# EAGLE design raspberrypi_to_ws2801_v4 (EAGLE 6.4)
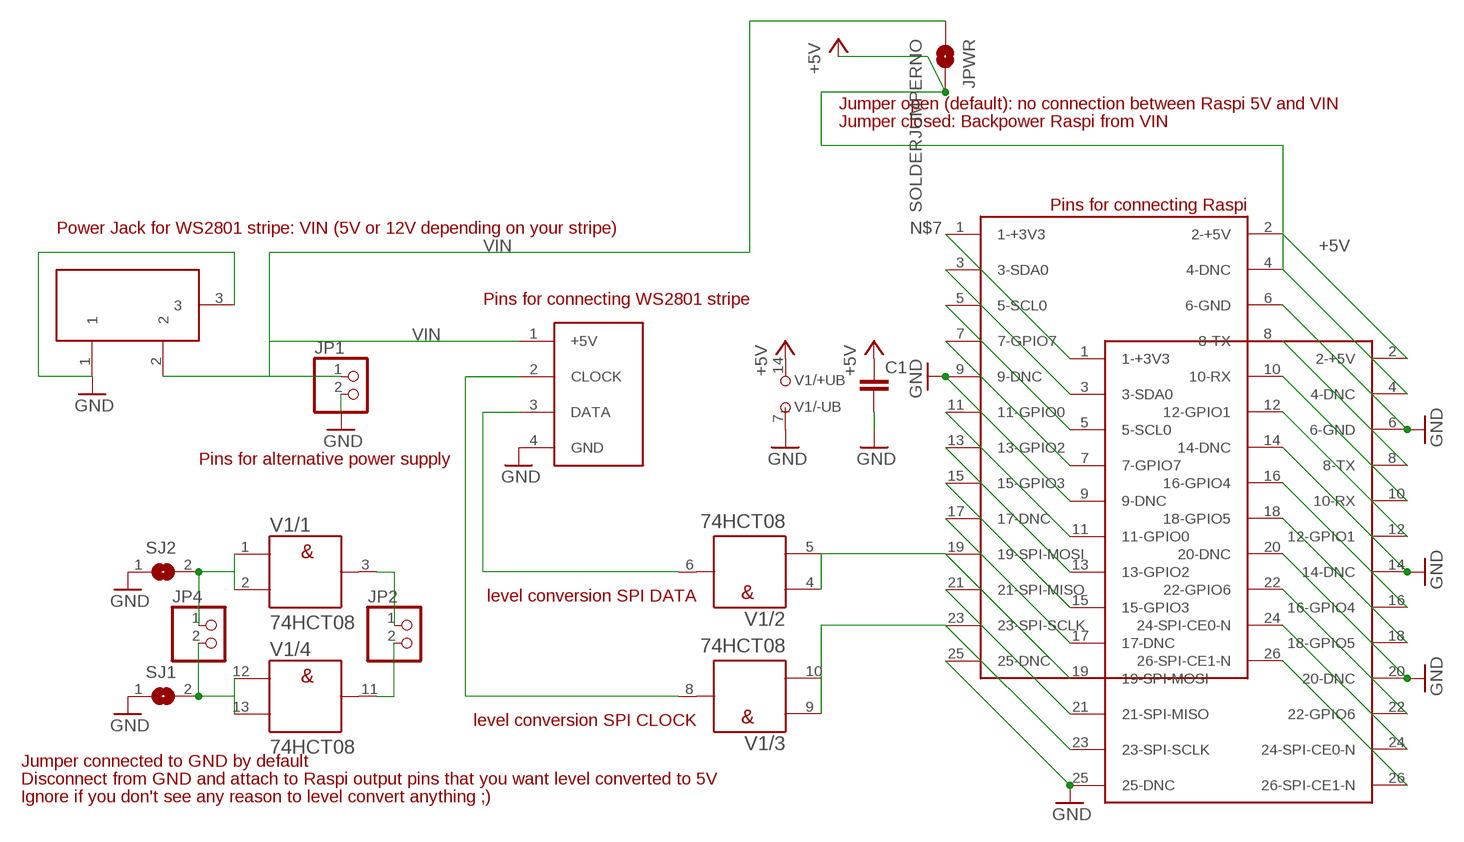
[diagram p0: schematic, sheet 1]

## Parts
C1  C-EU025-024X044  [C025-024X044]
JP1  PINHD-1X2  [1X02]
JP2  PINHD-1X2  [1X02]
JP4  PINHD-1X2  [1X02]
JPWR  SOLDERJUMPERNO  [SJ_2S-NO]
SJ1  SJ  [SJ]
SJ2  SJ  [SJ]
U$1  RASPBERRY-PI  [RASPBERRY-PI]
U$2  RASPBERRY-PI  [RASPBERRY-PI]
U$3  W2801STRIP  [1X04]
U$5  DC21MMX  [DC-21MM]
V1  74HCT08  7408N  [DIL14]

## Nets
+5V: C1.1 JPWR.2 U$1.2(2-+5V) U$1.4(4-DNC) U$2.2(2-+5V) U$2.4(4-DNC) V1.14(/+UB:+UB)
GND: C1.2 JP1.2 SJ1.1 SJ2.1 U$1.6(6-GND) U$1.9(9-DNC) U$1.14(14-DNC) U$1.20(20-DNC) U$1.25(25-DNC) U$2.6(6-GND) U$2.9(9-DNC) U$2.14(14-DNC) U$2.20(20-DNC) U$2.25(25-DNC) U$3.4(GND) U$5.1 U$5.3 V1.7(/-UB:-UB)
N$1: U$1.19(19-SPI-MOSI) U$2.19(19-SPI-MOSI) V1.4(/2:A) V1.5(/2:B)
N$2: U$3.2(CLOCK) V1.8(/3:Y)
N$3: U$1.23(23-SPI-SCLK) U$2.23(23-SPI-SCLK) V1.9(/3:A) V1.10(/3:B)
N$4: U$1.3(3-SDA0) U$2.3(3-SDA0)
N$6: U$1.5(5-SCL0) U$2.5(5-SCL0)
N$7: U$1.1(1-+3V3) U$2.1(1-+3V3)
N$8: U$1.7(7-GPIO7) U$2.7(7-GPIO7)
N$9: U$1.8(8-TX) U$2.8(8-TX)
N$11: U$1.10(10-RX) U$2.10(10-RX)
N$12: U$1.11(11-GPIO0) U$2.11(11-GPIO0)
N$13: U$1.12(12-GPIO1) U$2.12(12-GPIO1)
N$14: U$1.13(13-GPIO2) U$2.13(13-GPIO2)
N$16: U$1.15(15-GPIO3) U$2.15(15-GPIO3)
N$17: U$1.16(16-GPIO4) U$2.16(16-GPIO4)
N$18: U$1.17(17-DNC) U$2.17(17-DNC)
N$19: U$1.18(18-GPIO5) U$2.18(18-GPIO5)
N$21: U$1.21(21-SPI-MISO) U$2.21(21-SPI-MISO)
N$22: U$1.22(22-GPIO6) U$2.22(22-GPIO6)
N$23: U$1.24(24-SPI-CE0-N) U$2.24(24-SPI-CE0-N)
N$25: U$1.26(26-SPI-CE1-N) U$2.26(26-SPI-CE1-N)
N$26: U$3.3(DATA) V1.6(/2:Y)
N$27: JP2.1 V1.3(/1:Y)
N$28: JP2.2 V1.11(/4:Y)
N$33: JP4.2 SJ1.2 V1.12(/4:A) V1.13(/4:B)
N$34: JP4.1 SJ2.2 V1.1(/1:A) V1.2(/1:B)
VIN: JP1.1 JPWR.1 U$3.1(+5V) U$5.2

## Notes on the sheet
- Jumper open (default): no connection between Raspi 5V and VIN
- Jumper closed: Backpower Raspi from VIN
- Pins for connecting Raspi
- Power Jack for WS2801 stripe: VIN (5V or 12V depending on your stripe)
- Pins for connecting WS2801 stripe
- Pins for alternative power supply
- level conversion SPI DATA
- level conversion SPI CLOCK
- Jumper connected to GND by default
- Disconnect from GND and attach to Raspi output pins that you want level converted to 5V
- Ignore if you don't see any reason to level convert anything ;)

## Library data of the parts
C1 = rcl:C-EU: CAPACITOR, European symbol
JP1 = pinhead:PINHD-1X2: PIN HEADER
JP2 JP4 = pins:PINHD-1X2: PIN HEADER
JPWR = SparkFun-Passives:SOLDERJUMPER: Solder Jumper Standard SMD solder jumper. Used to automate production. Two varients : Normally Open and Normally Closed are the same, but have different paste layers. NC will have a large amount of paste and should jumper during reflow.
SJ1 SJ2 = jumper:SJ: SMD solder JUMPER
U$1 U$2 = RaspberryPi:RASPBERRY-PI: Raspberry Pi Board <http://www.raspberrypi.org/> Jacques Lagnel V1.0 (beta) 2012 Board dimension: Forum 3D model <http://www.raspberrypi.org/forum/general-discussion/mechanical-profile-3d-models?value=3d%20model&type=1&include=1&search=1&ret=all> The GPIO Connector (P1): http://elinux.org/RPi_Low-level_peripherals
U$3 = w2801strip:W2801STRIP
U$5 = powersupply:DC21MM
V1 = 74ttl-din:74*08: Quad 2-input AND gate

## Board
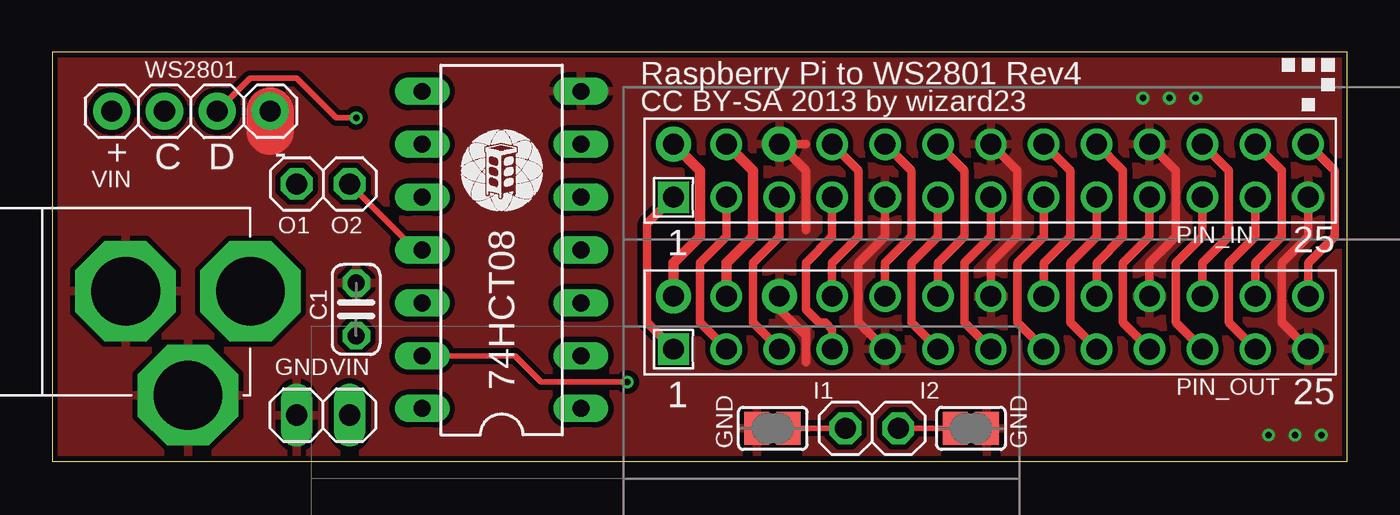
[diagram p1: board, top side]
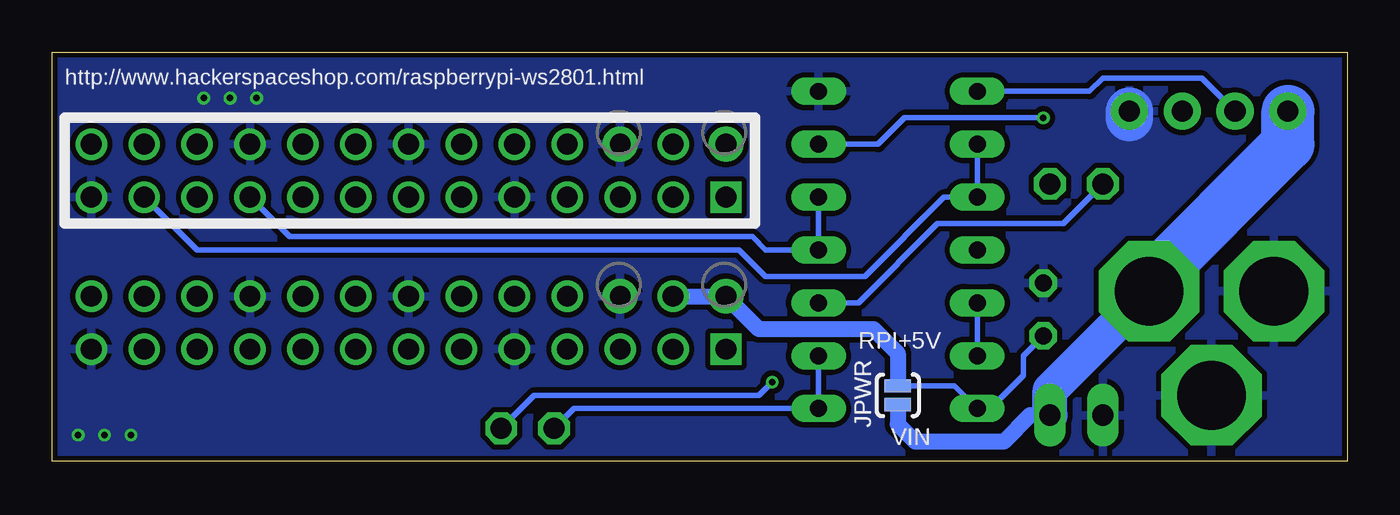
[diagram p2: board, bottom side, seen from below]

Size 62.21 x 19.67 mm. Coordinates in mm from the lower left corner, seen from the top.
Outline: 0,0 62.21,0 62.21,19.67 0,19.67 0,0
Copper layers (1*16): Top 0.035mm / dielectric 1.5mm / Bottom 0.035mm
Design rules "Fusion_eagle_rule_v1.1": minimum track width 6mil, minimum drill 12mil, track to track 6mil, track to pad 6mil, pad to pad 6mil, via to via 6mil, smd to smd 0mil, copper to edge 10mil, drill to drill 10mil, minimum pad ring 10mil, minimum via ring 6mil, stop-mask expansion 2mil, vias tented up to drill 100mil, thermal gap 10mil

### Footprints (pad centres in the part's own frame; a part is rotated, then mirrored left to right if it is on the bottom)
C025-024X044 = drill 0.813 octagon: 1 -1.27,0; 2 1.27,0
1X02 = drill 1.016 long: 1 -1.27,0; 2 1.27,0
1X02' = drill 1.016 octagon: 1 -1.27,0; 2 1.27,0
SJ_2S-NO = smd 0.635 x 1.27: 1 -0.45,0; 2 0.45,0
SJ = smd 1.168 x 1.6: 1 -0.762,0; 2 0.762,0
RASPBERRY-PI = drill 1 square: 1 0,0 | drill 1 pad 1.676: 2 0,2.54; 6 5.08,2.54 | drill 1: 3 2.54,0; 4 2.54,2.54; 5 5.08,0; 7 7.62,0; 8 7.62,2.54; 9 10.16,0; 10 10.16,2.54; 11 12.7,0; 12 12.7,2.54; 13 15.24,0; 14 15.24,2.54; 15 17.78,0; 16 17.78,2.54; 17 20.32,0; 18 20.32,2.54; 19 22.86,0; 20 22.86,2.54; 21 25.4,0; 22 25.4,2.54; 23 27.94,0; 24 27.94,2.54; 25 30.48,0; 26 30.48,2.54
1X04 = drill 1.016 pad 1.778: 1 -3.81,0; 2 -1.27,0; 3 1.27,0; 4 3.81,0
DC-21MM = drill 3.302 pad 4.826 octagon: 1 -5.08,-3.353; 2 -0.076,-6.35; 3 -0.076,-0.356
DIL14 = drill 0.813 long: 1 -7.62,-3.81; 2 -5.08,-3.81; 3 -2.54,-3.81; 4 0,-3.81; 5 2.54,-3.81; 6 5.08,-3.81; 7 7.62,-3.81; 8 7.62,3.81; 9 5.08,3.81; 10 2.54,3.81; 11 0,3.81; 12 -2.54,3.81; 13 -5.08,3.81; 14 -7.62,3.81

### Placement (x,y rotation side)
C1  14.61,7.3 90 top
JP1  13.02,2.22 180 top
JP2  [1X02']  13.02,13.34 0 top
JP4  [1X02']  39.37,1.59 0 top
JPWR  21.59,3.17 90 bottom
SJ1  44.13,1.59 180 top
SJ2  34.61,1.59 0 top
U$1  29.84,12.7 0 top
U$2  29.84,5.4 0 top
U$3  6.67,16.83 0 top
U$4  [METALAB_SMALL]  21.59,13.97 0 top
U$5  3.17,8.26 90 top
V1  21.59,10.16 90 top

### Tracks (layer width: path | path; a pad name or v marks a point on that pad's centre or on a via)
+5V
  Top 0.508: U$1.2 31.11,13.97 31.11,10.79 29.84,9.53 U$2.2 | U$1.4 33.66,13.97 33.66,10.79 32.38,9.53 U$2.4
  Bottom 0.254: C1.1 15.56,5.08 15.56,4.13 17.14,2.54 V1.14 18.86,3.62 JPWR.2
  Bottom 0.305: 21.59,3.81 JPWR.2
  Bottom 0.762: 21.59,3.81 21.59,5.19 22.75,6.35 28.26,6.35 U$2.2 U$2.4
GND  (via drill 0.31)
  Top 0.406: 34.92,8.57 U$2.6 34.92,7.62 | 36.2,11.11 36.2,13.97 U$1.6 36.2,15.24 | 36.2,6.03 36.2,4.76 | 36.2,6.03 36.2,6.35 | 34.92,7.3 36.2,6.03 | U$1.9 40.01,10.79 38.73,9.53 38.73,6.67 U$2.9 | U$1.14 46.35,13.97 46.35,10.79 45.09,9.53 U$2.14 | U$1.20 53.98,13.97 53.98,10.79 52.7,9.53 U$2.20 | U$1.25 60.33,10.79 59.05,9.53 59.05,6.67 U$2.25
  Top 2.286: U$3.4 10.48,15.88
  Bottom 2.286: U$3.4 10.48,16.51
  other vias: 52.39,17.46 59.69,1.27 60.96,1.27 53.66,17.46 54.93,17.46 58.42,1.27
  pour Top (isolate 0.254): 0,0 0,19.68 62.23,19.68 62.23,0
  pour Bottom (isolate 0.254): 0,19.68 62.23,19.68 62.23,0 0,0
N$1
  Top 0.406: U$2.19 51.44,6.67 51.44,9.53 52.7,10.79 U$1.19
  Bottom 0.254: V1.5 V1.4 27.94,10.16 28.57,10.79 50.8,10.79 U$1.19
N$2
  Bottom 0.254: V1.8 12.38,17.78 11.75,18.41 6.99,18.41 U$3.2
N$3
  Top 0.406: U$2.23 56.52,6.67 56.52,9.53 57.78,10.79 U$1.23
  Bottom 0.254: V1.9 V1.10 19.37,12.7 23.18,8.89 27.94,8.89 29.21,10.16 55.24,10.16 U$1.23
N$4
  Top 0.406: U$1.3 32.38,10.79 31.11,9.53 31.11,6.67 U$2.3
N$6
  Top 0.406: U$1.5 34.92,10.79 33.66,9.53 33.66,6.67 U$2.5
N$7
  Top 0.406: U$1.1 28.57,11.43 28.57,6.67 U$2.1
N$8
  Top 0.406: U$1.7 37.47,10.79 36.2,9.53 36.2,7.3 36.83,6.67 37.15,6.67 37.47,6.35 U$2.7
N$9
  Top 0.406: U$1.8 38.73,13.97 38.73,10.79 37.47,9.53 U$2.8
N$11
  Top 0.406: U$1.10 41.27,13.97 41.27,10.79 40.01,9.53 U$2.10
N$12
  Top 0.406: U$1.11 42.55,10.79 41.27,9.53 41.27,6.67 U$2.11
N$13
  Top 0.406: U$1.12 43.81,13.97 43.81,10.79 42.55,9.53 U$2.12
N$14
  Top 0.406: U$1.13 45.09,10.79 43.81,9.53 43.81,6.67 U$2.13
N$16
  Top 0.406: U$1.15 47.62,10.79 46.35,9.53 46.35,6.67 U$2.15
N$17
  Top 0.406: U$1.16 48.9,13.97 48.9,10.79 47.62,9.53 U$2.16
N$18
  Top 0.406: U$1.17 50.16,10.79 48.9,9.53 48.9,6.67 U$2.17
N$19
  Top 0.406: U$1.18 51.44,13.97 51.44,10.79 50.16,9.53 U$2.18
N$21
  Top 0.406: U$1.21 55.24,10.79 53.98,9.53 53.98,6.67 U$2.21
N$22
  Top 0.406: U$1.22 56.52,13.97 56.52,10.79 55.24,9.53 U$2.22
N$23
  Top 0.406: U$1.24 59.05,13.97 59.05,10.79 57.78,9.53 U$2.24
N$25
  Top 0.406: U$1.26 61.59,13.97 61.59,10.79 60.33,9.53 U$2.26
N$26  (via drill 0.31)
  Top 0.254: v14.61,16.51 13.65,16.51 11.75,18.41 9.53,18.41 U$3.3
  Bottom 0.254: V1.6 22.54,15.24 21.27,16.51 v14.61,16.51
N$27
  Bottom 0.254: V1.3 23.5,7.62 19.68,11.43 13.65,11.43 JP2.1
N$28
  Top 0.254: JP2.2 17.46,10.16 V1.11
N$29
  Top 0.16: 44.45,1.59 43.18,1.59
N$31
  Top 0.16: 34.29,1.59 35.56,1.59
N$33  (via drill 0.31)
  Top 0.254: V1.13 22.23,5.08 23.5,3.81 v27.62,3.81 | JP4.2 SJ1.2
  Bottom 0.254: V1.13 V1.12 | v27.62,3.81 28.26,3.17 39.05,3.17 JP4.2
N$34
  Top 0.254: JP4.1 SJ2.2
  Bottom 0.254: V1.2 V1.1 37.15,2.54 JP4.1
VIN
  Bottom 0.406: JPWR.1 21.59,2.54
  Bottom 0.762: JP1.1 15.24,2.22 16.51,0.95 20.75,0.95 21.59,1.79 21.59,2.54
  Bottom 1.676: JP1.1 14.29,3.42 U$5.2
  Bottom 2.54: U$5.2 9.53,8.57 2.86,15.24 U$3.1

### Text on the board
tNames: WS2801 | Raspberry Pi to WS2801 Rev4 | CC BY-SA 2013 by wizard23 | VIN | O1 | O2 | PIN_IN | GND | VIN | I1 | I2 | PIN_OUT | GND | GND
bNames: http://www.hackerspaceshop.com/raspberrypi-ws2801.html | RPI+5V | VIN
_tNames: C1
_bNames: JPWR